# EasyEDA Pro project ProPrj_Practice 4 layer_2025-08-23.epro, schematic Schematic3
Board Name: Board1; Create Date: 2025-08-22; Page Name: P1; Project Name: Practice 4 layer; Schematic Name: Schematic3; Update Date: 2025-08-22; Company: EasyEDA.com; Page Size: A4; Version: V1.0
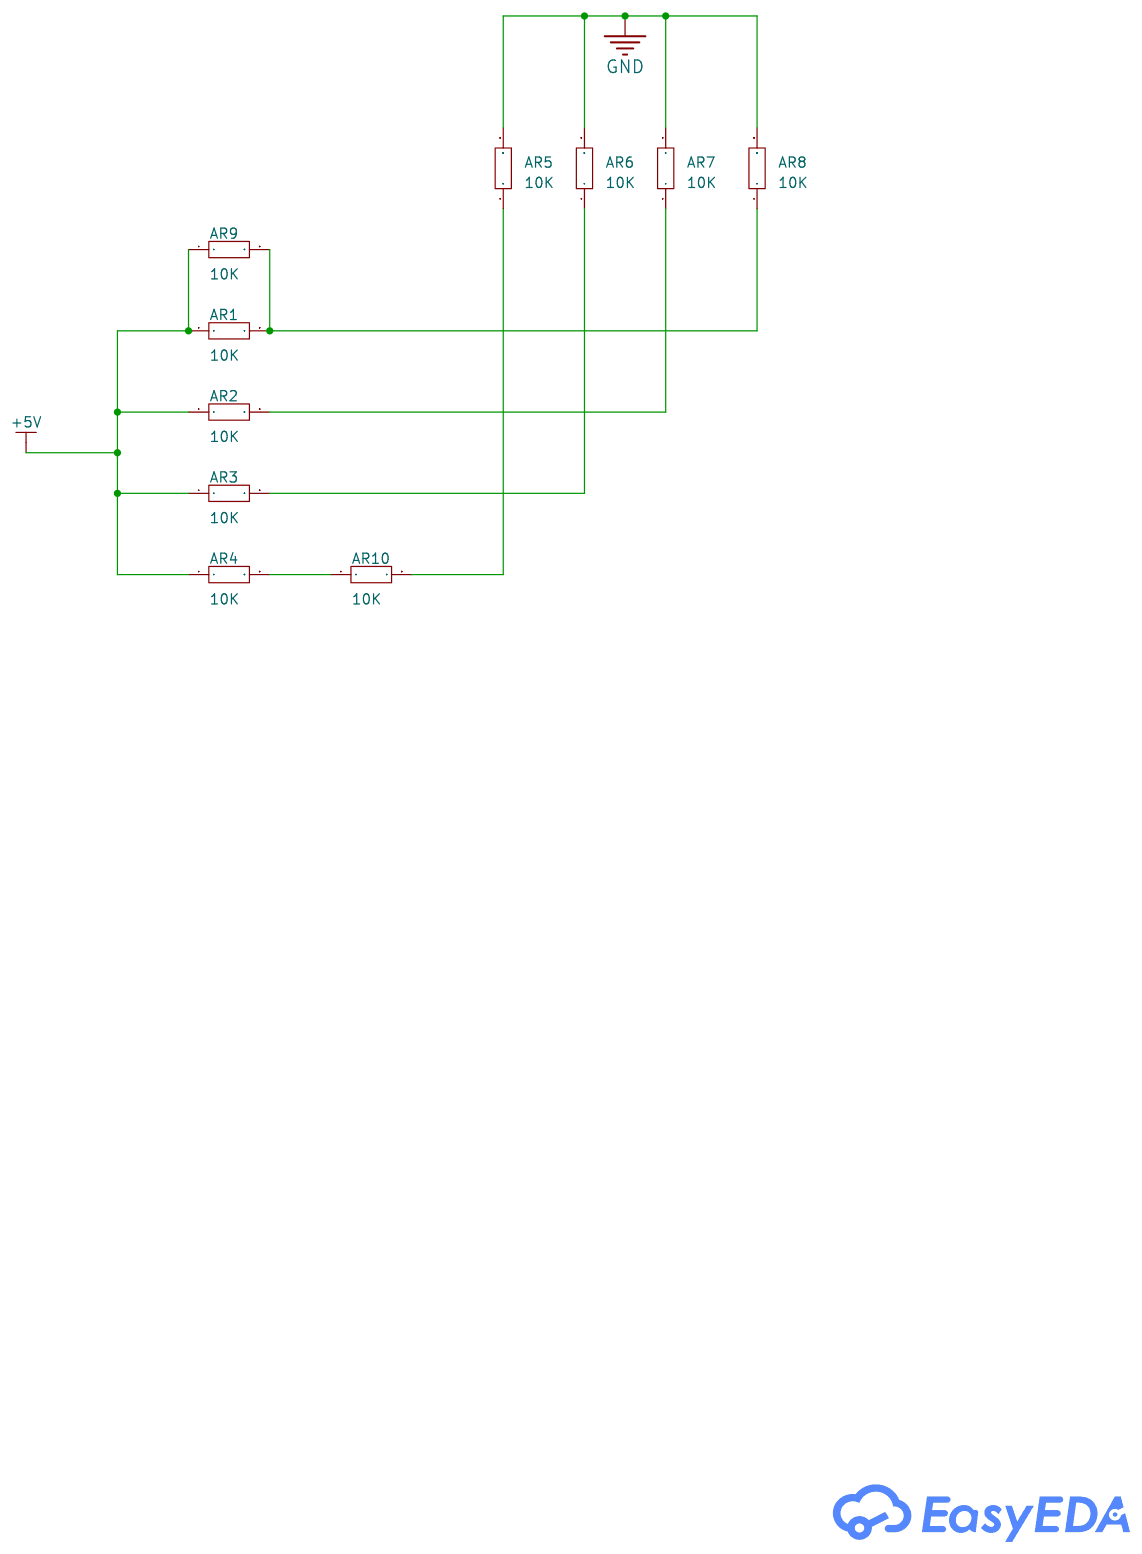
[diagram p8: schematic sheet]

## Parts
AR1  10K  [R0603]
AR2  10K  [R0603]
AR3  10K  [R0603]
AR4  10K  [R0603]
AR5  10K  [R0603]
AR6  10K  [R0603]
AR7  10K  [R0603]
AR8  10K  [R0603]
AR9  10K  [R0603]
AR10  10K  [R0603]

## Library data of the parts
AR1-AR10 = Res_0603: Supplier Footprint: 0603

## Nets
+5V: AR1.1 AR2.1 AR3.1 AR4.1 AR9.1
GND: AR5.2 AR6.2 AR7.2 AR8.2
$1N329: AR1.2 AR8.1 AR9.2
$1N334: AR2.2 AR7.1
$1N340: AR3.2 AR6.1
$1N346: AR5.1 AR10.2
$1N682: AR4.2 AR10.1
